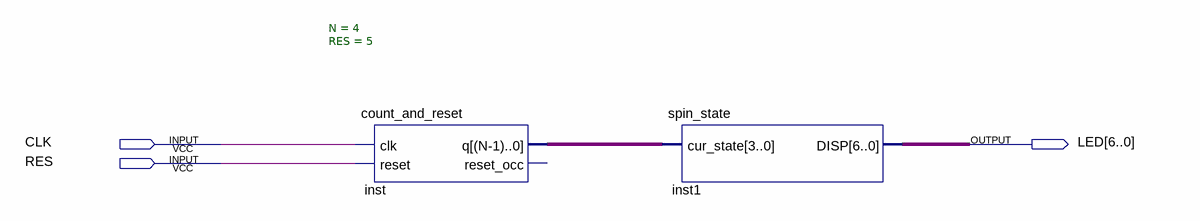
[diagram p0: schematic sheet]
// Quartus schematic segment_spin.bdf as structural Verilog: 2 symbols, 3 pins
module segment_spin (
  input  CLK,
  input  RES,
  output [6:0] LED
);

  wire [3:0] inst_q;

  count_and_reset #(.N(4), .RES(5)) inst (.clk(CLK), .reset(RES), .q(inst_q));  // open: reset_occ
  spin_state inst1 (.cur_state(inst_q), .DISP(LED));
endmodule
